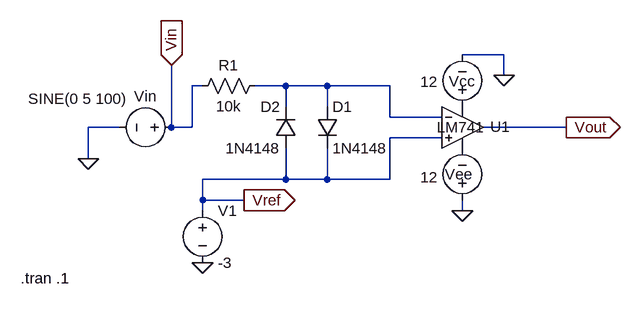
[diagram p0: schematic partA.asc]
partA.asc, the LTspice schematic file:
Version 4
SHEET 1 880 680
WIRE 240 96 176 96
WIRE 240 128 240 96
WIRE -224 144 -240 144
WIRE -96 144 -144 144
WIRE -32 144 -96 144
WIRE 64 144 -32 144
WIRE -96 176 -96 144
WIRE -32 176 -32 144
WIRE 64 192 64 144
WIRE 144 192 64 192
WIRE -352 208 -400 208
WIRE -272 208 -272 112
WIRE -240 208 -240 144
WIRE -240 208 -272 208
WIRE 336 208 208 208
WIRE 144 224 64 224
WIRE -400 256 -400 208
WIRE -96 288 -96 240
WIRE -96 288 -224 288
WIRE -32 288 -32 240
WIRE -32 288 -96 288
WIRE 64 288 64 224
WIRE 64 288 -32 288
WIRE -224 320 -224 288
WIRE -160 320 -224 320
WIRE -224 336 -224 320
WIRE 176 336 176 320
FLAG -224 416 0
FLAG -400 256 0
FLAG 240 128 0
FLAG 176 336 0
FLAG 336 208 Vout
IOPIN 336 208 Out
FLAG -272 112 Vin
IOPIN -272 112 In
FLAG -160 320 Vref
IOPIN -160 320 Out
SYMBOL LM741 176 144 R0
WINDOW 0 43 63 Left 2
WINDOW 3 -39 64 Left 2
SYMATTR InstName U1
SYMBOL res -128 128 R90
WINDOW 0 0 56 VBottom 2
WINDOW 3 32 56 VTop 2
SYMATTR InstName R1
SYMATTR Value 10k
SYMBOL voltage -256 208 R90
WINDOW 0 -32 56 VBottom 2
WINDOW 3 -60 160 VTop 2
WINDOW 123 0 0 Left 0
WINDOW 39 0 0 Left 0
SYMATTR InstName Vin
SYMATTR Value SINE(0 5 100)
SYMBOL voltage 176 192 R180
WINDOW 0 -19 55 Left 2
WINDOW 3 38 54 Left 2
WINDOW 123 0 0 Left 0
WINDOW 39 0 0 Left 0
SYMATTR InstName Vcc
SYMATTR Value 12
SYMBOL voltage 176 336 R180
WINDOW 0 -16 56 Left 2
WINDOW 3 38 51 Left 2
WINDOW 123 0 0 Left 0
WINDOW 39 0 0 Left 0
SYMATTR InstName Vee
SYMATTR Value 12
SYMBOL voltage -224 320 R0
WINDOW 123 0 0 Left 0
WINDOW 39 0 0 Left 0
SYMATTR InstName V1
SYMATTR Value -3
SYMBOL diode -48 176 R0
SYMATTR InstName D1
SYMATTR Value 1N4148
SYMBOL diode -80 240 R180
WINDOW 0 24 64 Left 2
WINDOW 3 24 0 Left 2
SYMATTR InstName D2
SYMATTR Value 1N4148
TEXT -504 440 Left 2 !.tran .1

The netlist it stands for:
* partA.asc
XU1 Vref N001 P001 P002 Vout LM741  ; pins In+ In- V+ V- OUT
R1 N001 Vin 10k
Vin Vin 0 SINE(0 5 100)
Vcc P001 0 12
Vee 0 P002 12
V1 Vref 0 -3
D1 N001 Vref 1N4148
D2 Vref N001 1N4148
.model D D
.lib standard.dio
.tran .1
.lib LM741.lib
.backanno
.end